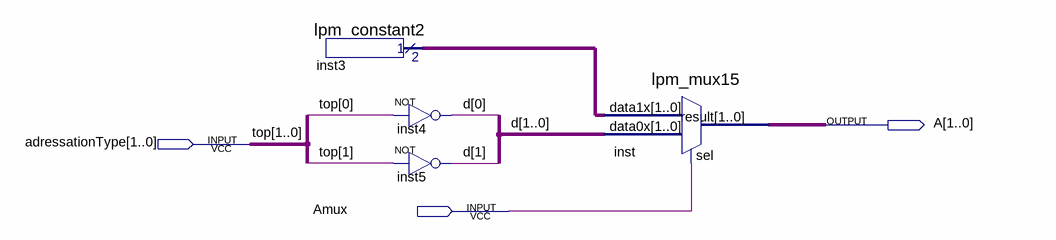
[diagram p0: schematic sheet]
// Quartus schematic KS.bdf as structural Verilog: 4 symbols, 3 pins
module KS (
  input  [1:0] adressationType,
  input  Amux,
  output [1:0] A
);

  wire [1:0] d, inst3_result;

  lpm_constant2 inst3 (.result(inst3_result));
  not inst4 (d[0], adressationType[0]);
  not inst5 (d[1], adressationType[1]);
  lpm_mux15 inst (.data1x(inst3_result), .data0x(d), .sel(Amux), .result(A));

  // Other names for the same wires on the sheet: top[1:0] = adressationType
endmodule
